# Altium schematic sheet Cover_Page.SchDoc: Cover Page
size 292 x 193 mm; SheetNumber: 1; SheetTotal: 12; SheetSize: A4
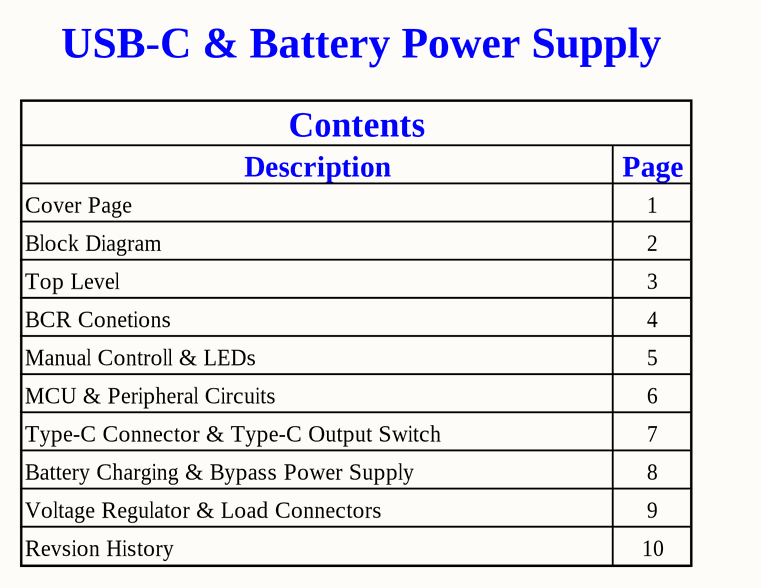
[diagram p0: Cover_Page.SchDoc]

## Notes on the sheet
- USB-C & Battery Power Supply
- Project :
- Size:
- Title:
- Drawn by:
- Variant:
- Rev:
- Date:
- Sheet:
- of